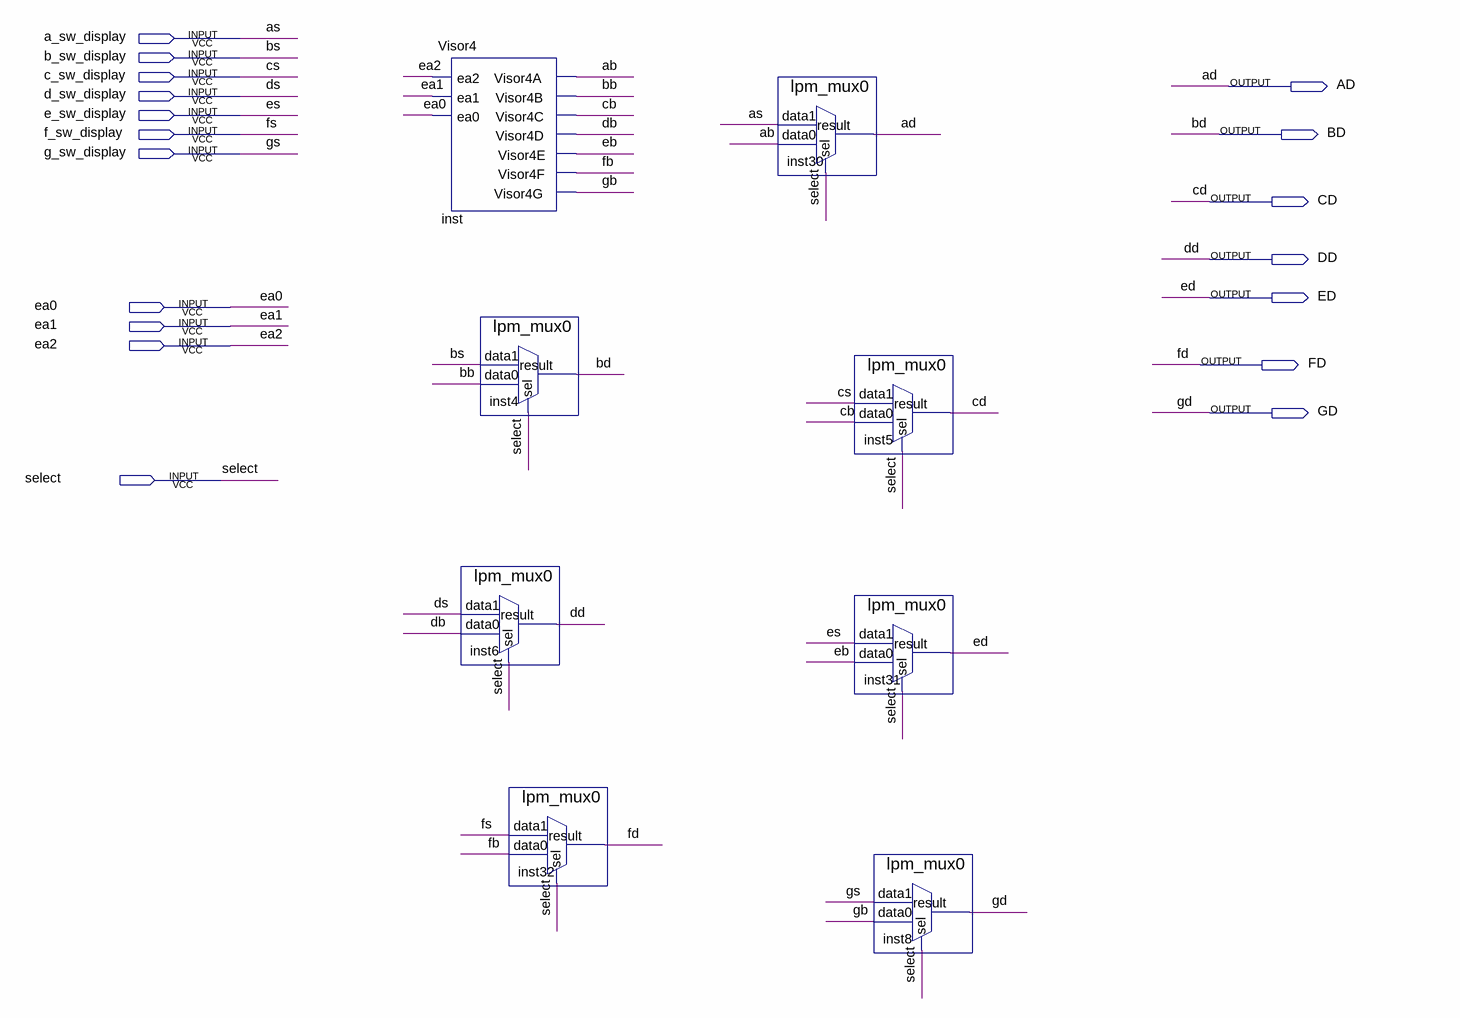
[diagram p0: schematic sheet]
// Quartus schematic select_display3.bdf as structural Verilog: 8 symbols, 18 pins
module select_display3 (
  input  a_sw_display,
  input  b_sw_display,
  input  c_sw_display,
  input  d_sw_display,
  input  e_sw_display,
  input  f_sw_display,
  input  g_sw_display,
  input  ea0,
  input  ea1,
  input  ea2,
  input  select,
  output AD,
  output BD,
  output CD,
  output DD,
  output ED,
  output FD,
  output GD
);

  wire ab, bb, cb, db, eb, fb, gb;

  Visor4 inst (
    .ea2(ea2), .ea1(ea1), .ea0(ea0), .Visor4A(ab), .Visor4B(bb), .Visor4C(cb), .Visor4D(db), .Visor4E(eb),
    .Visor4F(fb), .Visor4G(gb));
  lpm_mux0 inst4 (.data1(b_sw_display), .data0(bb), .sel(select), .result(BD));
  lpm_mux0 inst6 (.data1(d_sw_display), .data0(db), .sel(select), .result(DD));
  lpm_mux0 inst32 (.data1(f_sw_display), .data0(fb), .sel(select), .result(FD));
  lpm_mux0 inst30 (.data1(a_sw_display), .data0(ab), .sel(select), .result(AD));
  lpm_mux0 inst5 (.data1(c_sw_display), .data0(cb), .sel(select), .result(CD));
  lpm_mux0 inst31 (.data1(e_sw_display), .data0(eb), .sel(select), .result(ED));
  lpm_mux0 inst8 (.data1(g_sw_display), .data0(gb), .sel(select), .result(GD));

  // Other names for the same wires on the sheet: as = a_sw_display; bs = b_sw_display; cs = c_sw_display;
  //   ds = d_sw_display; es = e_sw_display; fs = f_sw_display; gs = g_sw_display
endmodule
